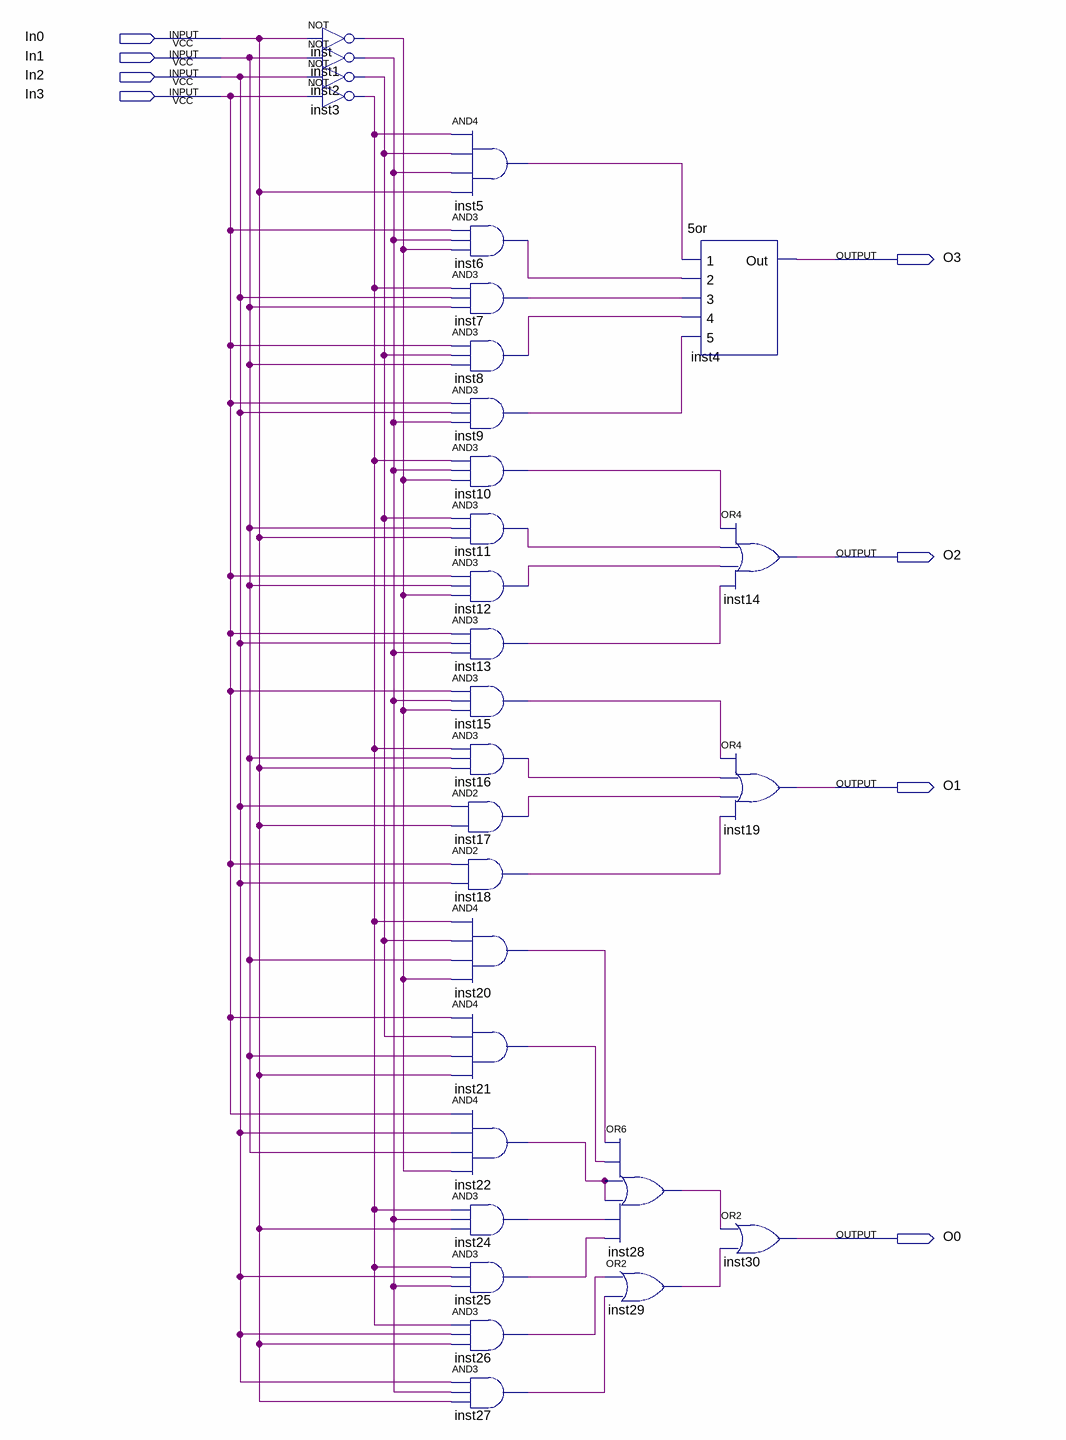
[diagram p0: schematic sheet]
// Quartus schematic RA_Ordem.bdf as structural Verilog: 30 symbols, 8 pins
module RA_Ordem (
  input  In0,
  input  In1,
  input  In2,
  input  In3,
  output O3,
  output O2,
  output O1,
  output O0
);

  wire inst1_out, inst2_out, inst3_out, inst5_out, inst6_out, inst7_out, inst8_out, inst9_out, inst10_out,
       inst11_out, inst12_out, inst13_out, inst15_out, inst16_out, inst17_out, inst18_out, inst20_out,
       inst21_out, inst22_out, inst24_out, inst25_out, inst26_out, inst27_out, inst28_out, inst29_out,
       inst_out;

  not inst (inst_out, In0);
  not inst1 (inst1_out, In1);
  not inst2 (inst2_out, In2);
  not inst3 (inst3_out, In3);
  and inst5 (inst5_out, inst3_out, inst2_out, inst1_out, In0);
  and inst6 (inst6_out, In3, inst1_out, inst_out);
  and inst7 (inst7_out, inst3_out, In2, In1);
  and inst8 (inst8_out, In3, inst2_out, In1);
  and inst9 (inst9_out, In3, In2, inst1_out);
  and inst10 (inst10_out, inst3_out, inst1_out, inst_out);
  and inst11 (inst11_out, inst2_out, In1, In0);
  and inst12 (inst12_out, In3, In1, inst_out);
  and inst13 (inst13_out, In3, In2, inst1_out);
  and inst15 (inst15_out, In3, inst1_out, inst_out);
  and inst16 (inst16_out, inst3_out, In1, In0);
  and inst17 (inst17_out, In2, In0);
  and inst18 (inst18_out, In3, In2);
  and inst20 (inst20_out, inst3_out, inst2_out, In1, inst_out);
  and inst21 (inst21_out, In3, inst2_out, In1, In0);
  and inst22 (inst22_out, In3, In2, In1, inst_out);
  and inst24 (inst24_out, inst3_out, inst1_out, In0);
  and inst25 (inst25_out, inst3_out, In2, inst1_out);
  and inst26 (inst26_out, inst3_out, In2, In0);
  and inst27 (inst27_out, In2, inst1_out, In0);
  or inst28 (inst28_out, inst20_out, inst21_out, inst22_out, inst22_out, inst24_out, inst25_out);
  or inst29 (inst29_out, inst26_out, inst27_out);
  \5or  inst4 (.\1 (inst5_out), .\2 (inst6_out), .\3 (inst7_out), .\4 (inst8_out), .\5 (inst9_out), .Out(O3));
  or inst14 (O2, inst10_out, inst11_out, inst12_out, inst13_out);
  or inst19 (O1, inst15_out, inst16_out, inst17_out, inst18_out);
  or inst30 (O0, inst28_out, inst29_out);
endmodule
